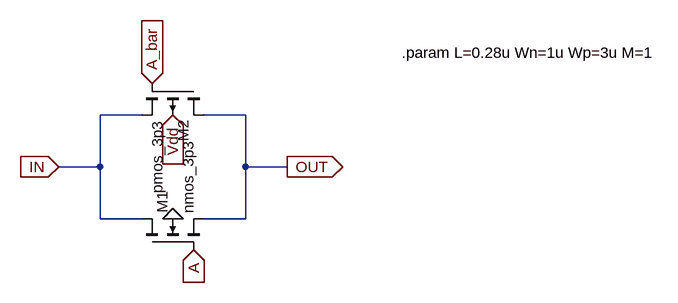
[diagram p0: schematic TGATE.asc]
TGATE.asc, the LTspice schematic file:
Version 4
SHEET 1 996 680
WIRE 160 64 96 64
WIRE 320 64 256 64
WIRE 96 144 96 64
WIRE 96 144 32 144
WIRE 320 144 320 64
WIRE 384 144 320 144
WIRE 96 224 96 144
WIRE 160 224 96 224
WIRE 320 224 320 144
WIRE 320 224 256 224
FLAG 208 224 0
FLAG 32 144 IN
IOPIN 32 144 In
FLAG 384 144 OUT
IOPIN 384 144 Out
FLAG 240 272 A
IOPIN 240 272 In
FLAG 176 16 A_bar
IOPIN 176 16 In
FLAG 208 64 Vdd
IOPIN 208 64 In
SYMBOL nmos4 160 272 R270
SYMATTR InstName M1
SYMATTR Value nmos_3p3
SYMATTR Value2 l='L' w='Wn' m='M'
SYMBOL pmos4 256 16 R90
SYMATTR InstName M2
SYMATTR Value pmos_3p3
SYMATTR Value2 l='L' w='Wp' m='M'
TEXT 560 -32 Left 2 !.param L=0.28u Wn=1u Wp=3u M=1

The netlist it stands for:
* TGATE.asc
M1 IN A OUT 0 nmos_3p3 l='L' w='Wn' m='M'
M2 OUT A_bar IN Vdd pmos_3p3 l='L' w='Wp' m='M'
.model NMOS NMOS
.model PMOS PMOS
.lib standard.mos
.param L=0.28u Wn=1u Wp=3u M=1
.backanno
.end